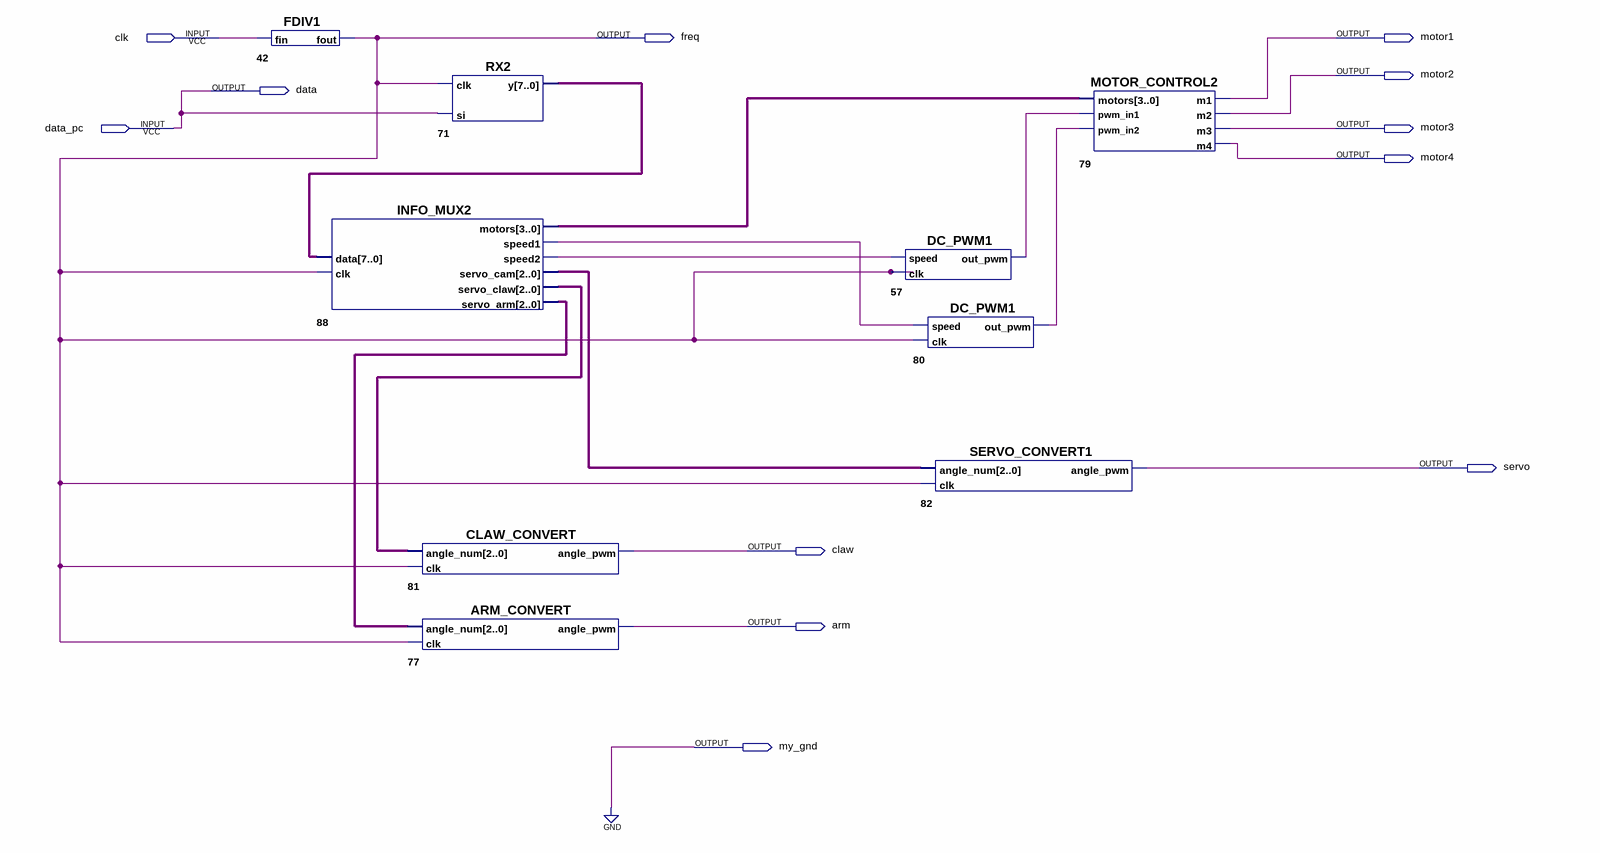
[diagram p0: schematic sheet]
// Quartus schematic everything.bdf as structural Verilog: 9 symbols, 12 pins
module everything (
  input  clk,
  input  data_pc,
  output freq,
  output motor1,
  output motor2,
  output data,
  output motor3,
  output motor4,
  output servo,
  output claw,
  output arm,
  output my_gnd
);

  wire n57_out_pwm, n80_out_pwm, n88_speed1, n88_speed2;
  wire [2:0] n88_servo_arm, n88_servo_cam, n88_servo_claw;
  wire [3:0] n88_motors;
  wire [7:0] n71_y;

  FDIV1 u_42 (.fin(clk), .fout(freq));
  INFO_MUX2 u_88 (
    .data(n71_y), .clk(freq), .motors(n88_motors), .speed1(n88_speed1), .speed2(n88_speed2),
    .servo_cam(n88_servo_cam), .servo_claw(n88_servo_claw), .servo_arm(n88_servo_arm));
  RX2 u_71 (.clk(freq), .si(data_pc), .y(n71_y));
  CLAW_CONVERT u_81 (.angle_num(n88_servo_claw), .clk(freq), .angle_pwm(claw));
  ARM_CONVERT u_77 (.angle_num(n88_servo_arm), .clk(freq), .angle_pwm(arm));
  DC_PWM1 u_57 (.speed(n88_speed2), .clk(freq), .out_pwm(n57_out_pwm));
  DC_PWM1 u_80 (.speed(n88_speed1), .clk(freq), .out_pwm(n80_out_pwm));
  SERVO_CONVERT1 u_82 (.angle_num(n88_servo_cam), .clk(freq), .angle_pwm(servo));
  MOTOR_CONTROL2 u_79 (
    .motors(n88_motors), .pwm_in1(n57_out_pwm), .pwm_in2(n80_out_pwm), .m1(motor1), .m2(motor2), .m3(motor3),
    .m4(motor4));

  assign data = data_pc;
  assign my_gnd = 1'b0;
endmodule
